# EAGLE schematic ServoCape_Rev2 (EAGLE 7.2.0)

## Sheet 1 of 4
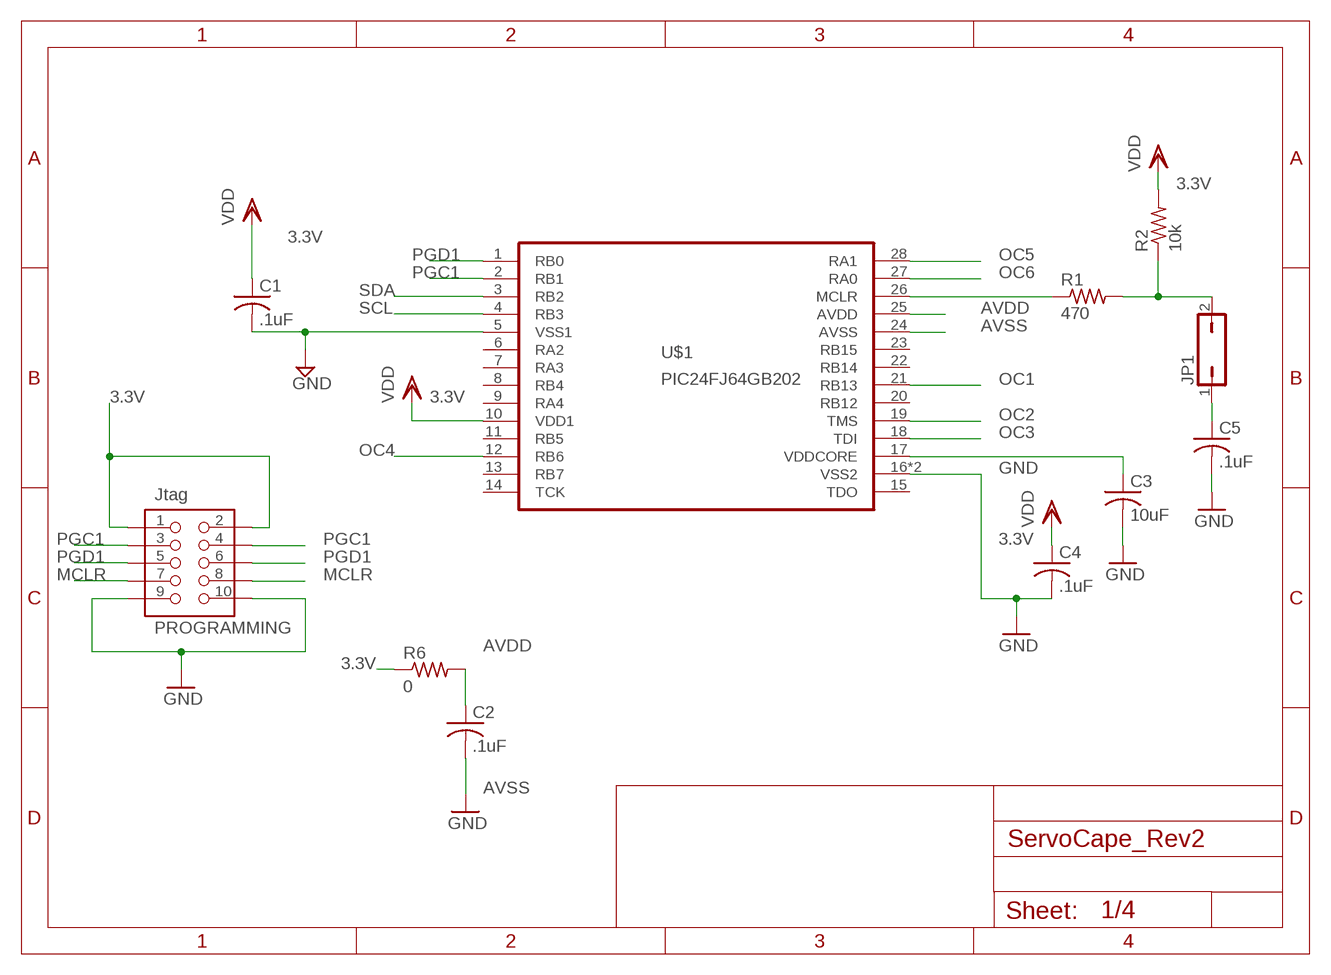
[diagram p0: schematic, sheet 1]

### Parts
C1  .1uF  C-USC0805K  [C0805K]
C2  .1uF  C-USC0805K  [C0805K]
C3  10uF  C-USC0805K  [C0805K]
C4  .1uF  C-USC0805K  [C0805K]
C5  .1uF  C-USC0805  [C0805]
JP1  JP1Q  [JP1]
PROGRAMMING  Jtag  MOTHER-BOARD-REV5_PIN-CONNECTOR74089  [MOTHER-BOARD-REV5_10-PIN-SMD]
R1  470  R-US_R0805  [R0805]
R2  10k  R-US_R0805  [R0805]
R6  0  R-US_R0402  [R0402]
U$1  PIC24FJ64GB202  [PIC24FJ64GB202]

### Nets
3.3V: C1.1 C4.1 PROGRAMMING.1 PROGRAMMING.2 R2.2 R6.1 U$1.10(VDD1) ; supply symbol labelled VDD ; also sheet 2
AVDD: C2.1 R6.2 U$1.25(AVDD)
AVSS: C2.2 U$1.24(AVSS) ; supply symbol labelled GND
GND: C1.2 C3.2 C4.2 C5.2 PROGRAMMING.9 PROGRAMMING.10 U$1.5(VSS1) U$1.16(VSS2) U$1.EXP(VSS2) ; also sheet 2,3,4
MCLR: PROGRAMMING.7 PROGRAMMING.8
N$1: JP1.2 R1.2 R2.1
N$2: R1.1 U$1.26(MCLR)
N$3: C3.1 U$1.17(VDDCORE)
N$4: C5.1 JP1.1
OC1: U$1.21(RB13) ; also sheet 4
OC2: U$1.19(TMS) ; also sheet 4
OC3: U$1.18(TDI) ; also sheet 4
OC4: U$1.12(RB6) ; also sheet 4
OC5: U$1.28(RA1) ; also sheet 4
OC6: U$1.27(RA0) ; also sheet 4
PGC1: PROGRAMMING.3 PROGRAMMING.4 U$1.2(RB1)
PGD1: PROGRAMMING.5 PROGRAMMING.6 U$1.1(RB0)
SCL: U$1.4(RB3) ; also sheet 3
SDA: U$1.3(RB2) ; also sheet 3
Unconnected: U$1.6(RA2) U$1.7(RA3) U$1.8(RB4) U$1.9(RA4) U$1.11(RB5) U$1.13(RB7) U$1.14(TCK) U$1.15(TDO) U$1.20(RB12) U$1.22(RB14) U$1.23(RB15)

## Sheet 2 of 4: Power System
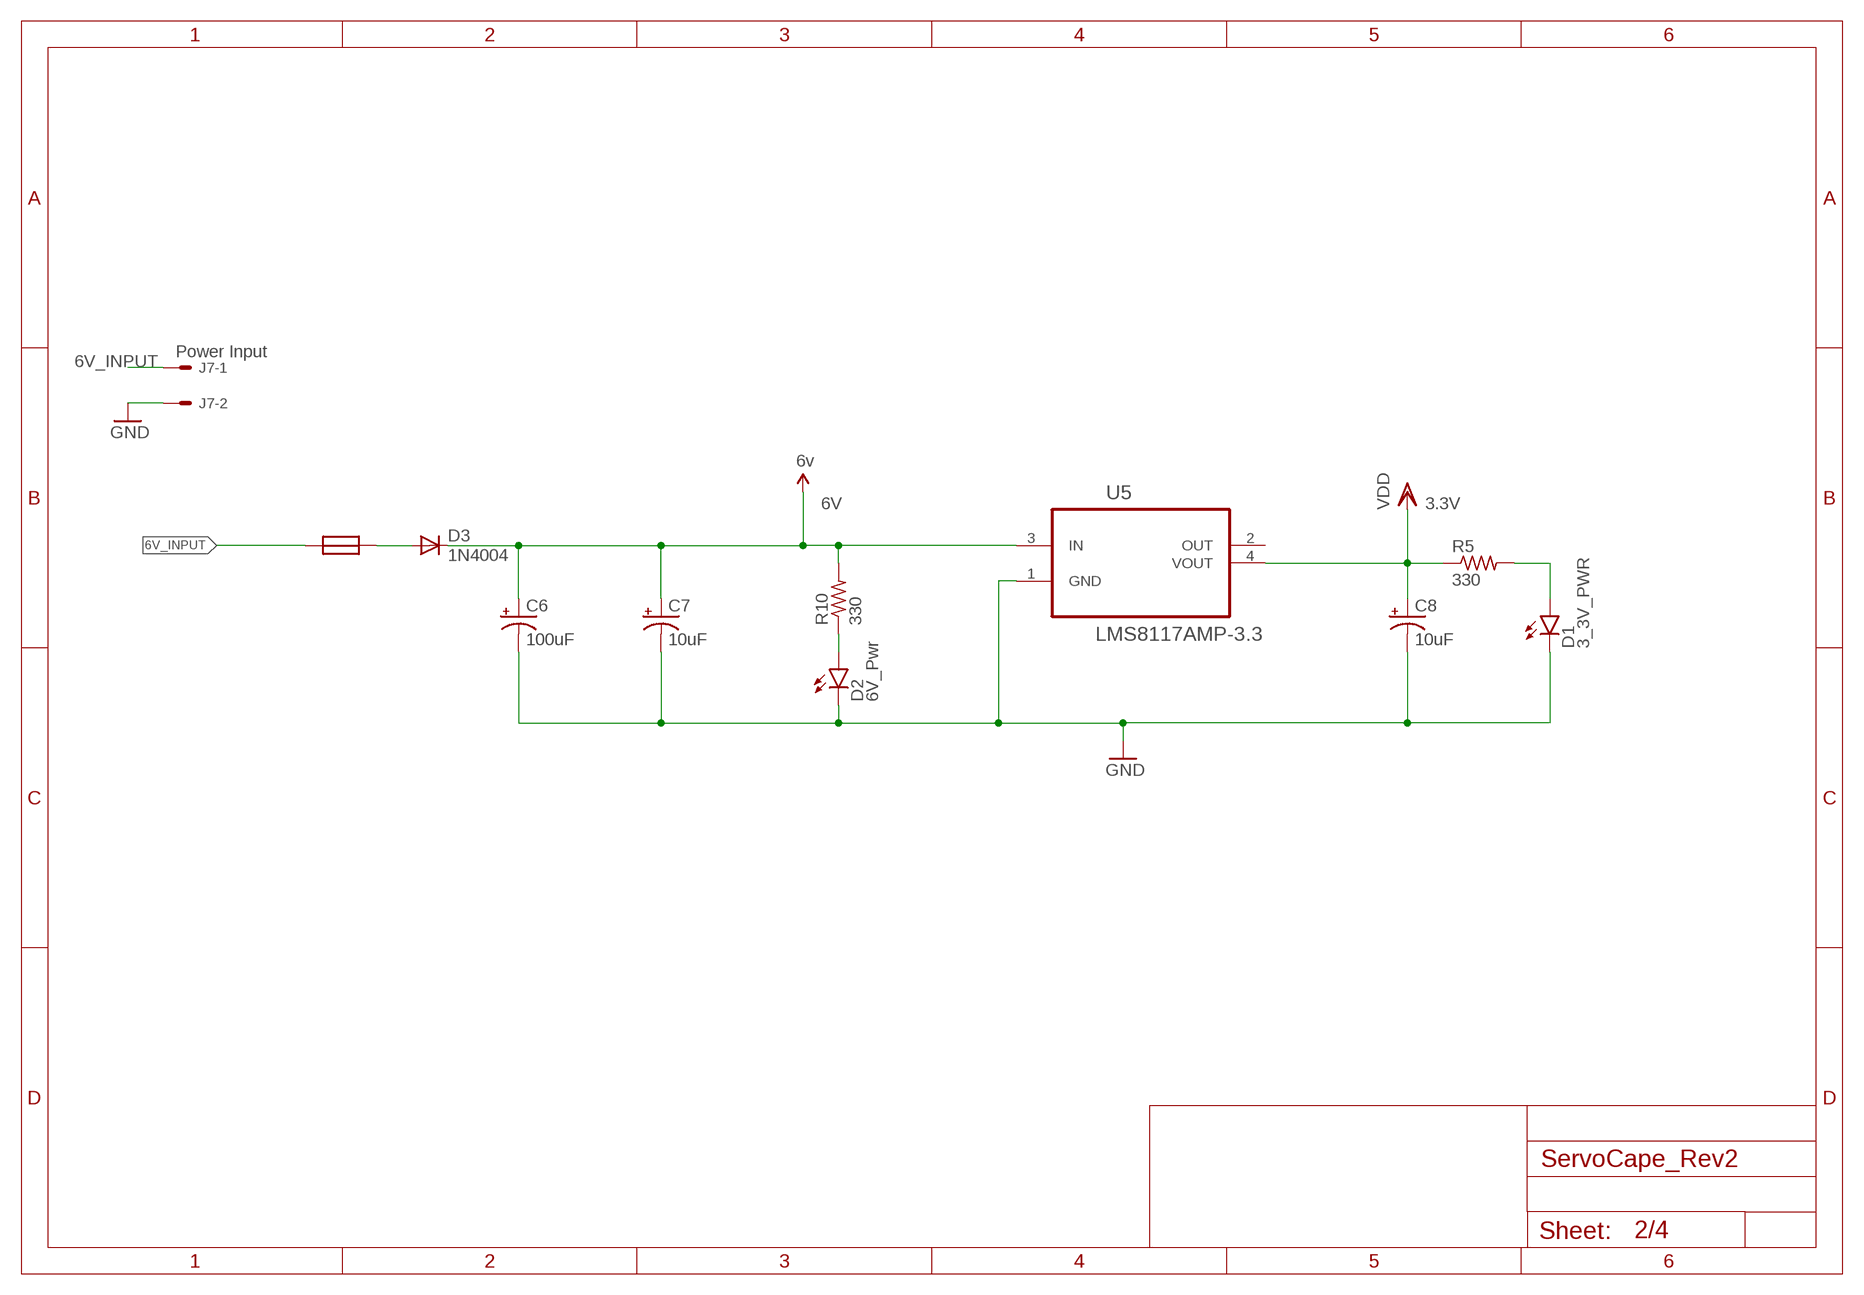
[diagram p1: schematic, sheet 2]

### Parts
C6  100uF  100UF-10V-10%(TANT)  [EIA7343]
C7  10uF  10UF-16V-10%(TANT)  [EIA3216]
C8  10uF  10UF-16V-10%(TANT)  [EIA3216]
D1  3_3V_PWR  LED-FKIT-1206  [FKIT-LED-1206]
D2  6V_Pwr  LED-FKIT-1206  [FKIT-LED-1206]
D3  1N4004  [DO41-10]
J7  Power Input  22-05-7028-02  [7395-02]
R5  330  R-US_R0805W  [R0805W]
R10  330  R-US_R0805W  [R0805W]
U5  LMS8117AMP-3.3  [SOT230P696X180-4N]
U$3  NANO_FUSE  [NANO_FUSE]

### Nets
3.3V: C8.A(+) R5.1 U5.4(VOUT) ; supply symbol labelled VDD ; also sheet 1
6V: C6.A(+) C7.A(+) D3.C R10.2 U5.3(IN) ; supply symbol labelled 6v ; also sheet 4
6V_INPUT: J7.1 U$3.1
GND: C6.C(-) C7.C(-) C8.C(-) D1.C D2.C J7.2 U5.1(GND) ; also sheet 1,3,4
N$6: D1.A R5.2
N$13: D2.A R10.1
N$14: D3.A U$3.2
Unconnected: U5.2(OUT)

## Sheet 3 of 4
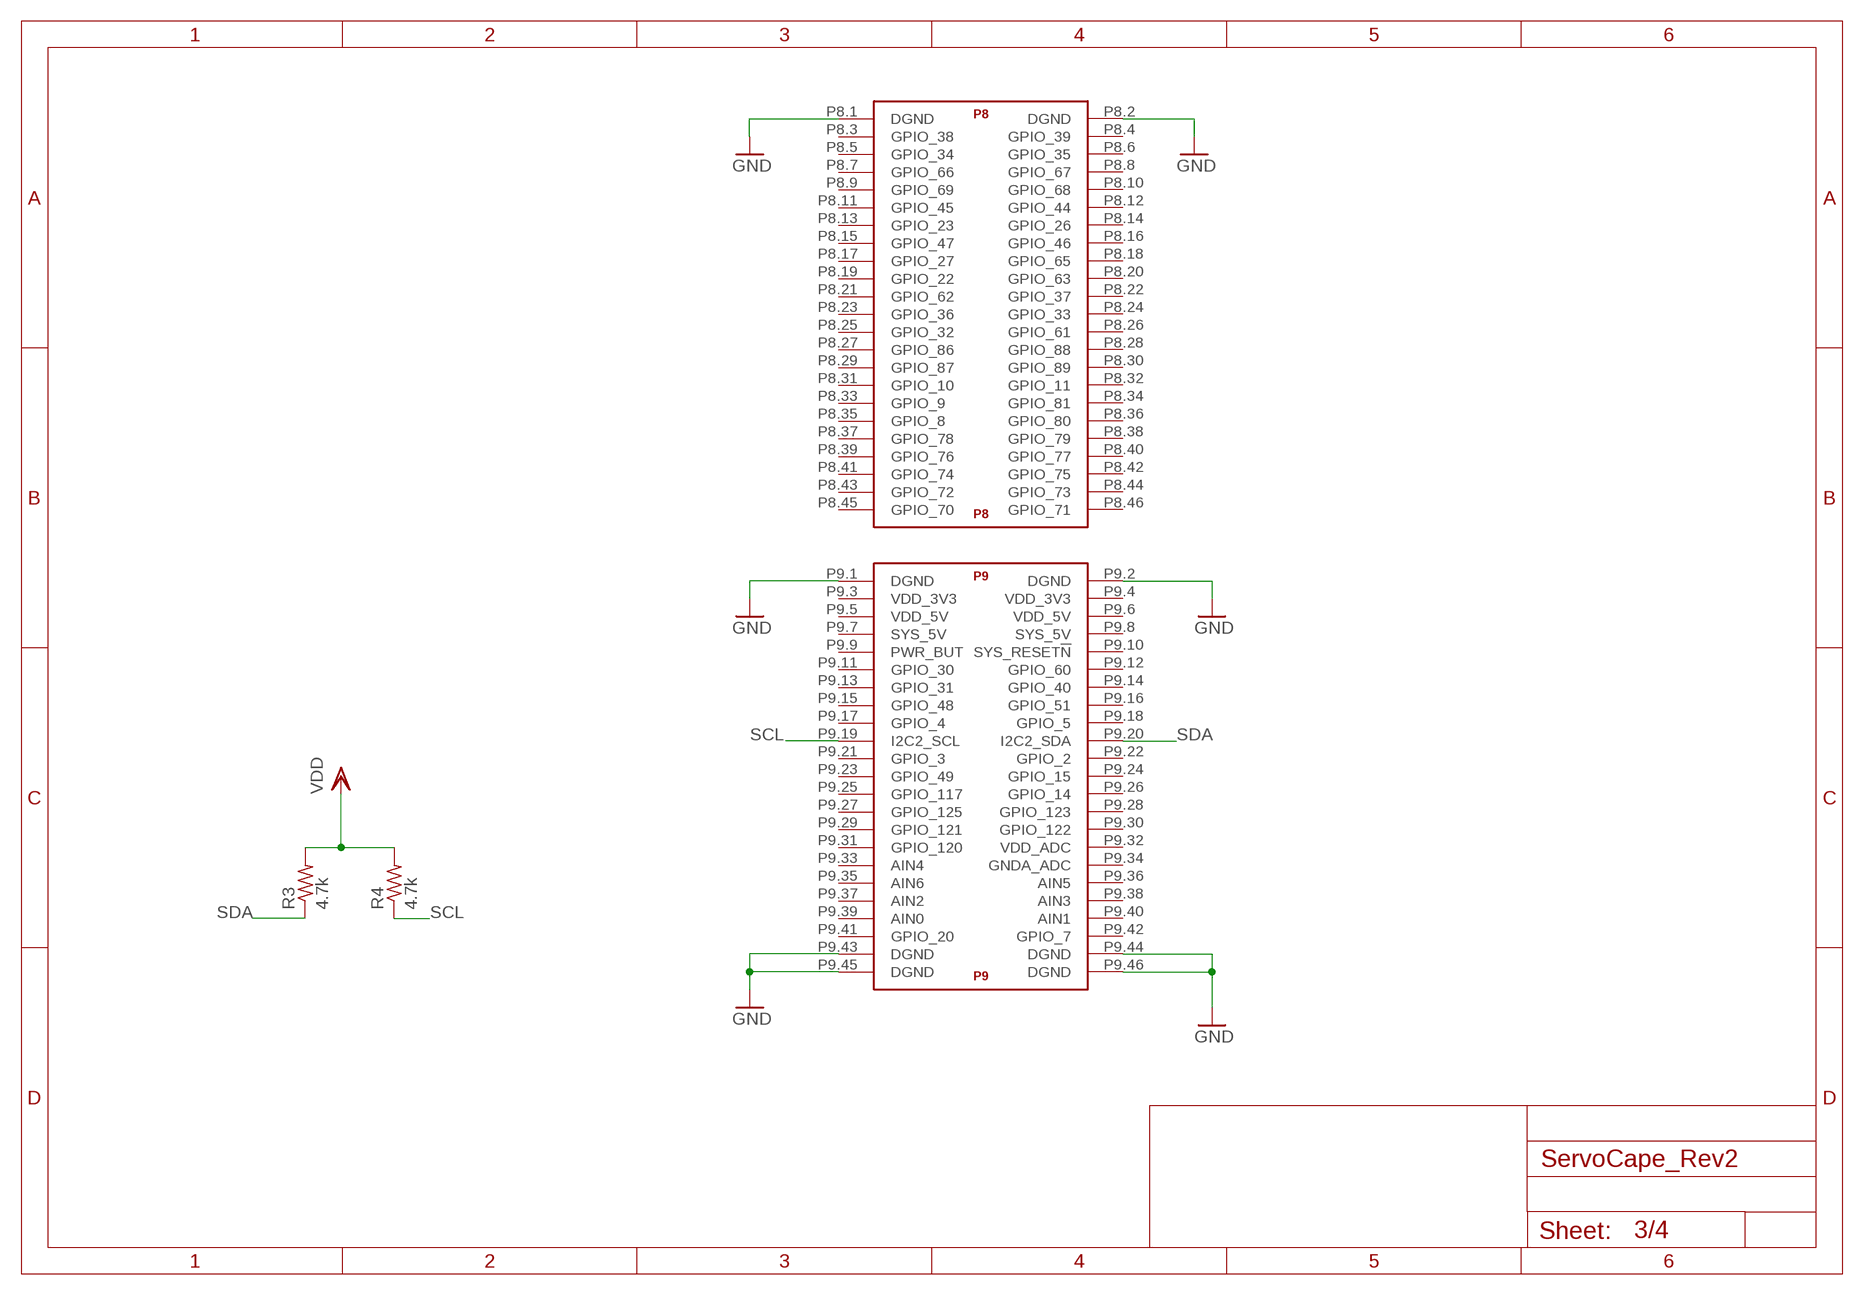
[diagram p2: schematic, sheet 3]

### Parts
R3  4.7k  R-US_R0805  [R0805]
R4  4.7k  R-US_R0805  [R0805]
U$2  BEAGLE_BONE_BLACK_CAPE  [BEAGLE_BONE_BLACK_CAPE]

### Nets
GND: U$2.P8.1(P8:DGND) U$2.P8.2(P8:DGND) U$2.P9.1(P9:DGND) U$2.P9.2(P9:DGND) U$2.P9.43(P9:DGND) U$2.P9.44(P9:DGND) U$2.P9.45(P9:DGND) U$2.P9.46(P9:DGND) ; also sheet 1,2,4
SCL: R4.1 U$2.P9.19(P9:I2C2_SCL) ; also sheet 1
SDA: R3.1 U$2.P9.20(P9:I2C2_SDA) ; also sheet 1
VDD: R3.2 R4.2
Unconnected: U$2.P8.3(P8:GPIO_38) U$2.P8.4(P8:GPIO_39) U$2.P8.5(P8:GPIO_34) U$2.P8.6(P8:GPIO_35) U$2.P8.7(P8:GPIO_66) U$2.P8.8(P8:GPIO_67) U$2.P8.9(P8:GPIO_69) U$2.P8.10(P8:GPIO_68) U$2.P8.11(P8:GPIO_45) U$2.P8.12(P8:GPIO_44) U$2.P8.13(P8:GPIO_23) U$2.P8.14(P8:GPIO_26) U$2.P8.15(P8:GPIO_47) U$2.P8.16(P8:GPIO_46) U$2.P8.17(P8:GPIO_27) U$2.P8.18(P8:GPIO_65) U$2.P8.19(P8:GPIO_22) U$2.P8.20(P8:GPIO_63) U$2.P8.21(P8:GPIO_62) U$2.P8.22(P8:GPIO_37) U$2.P8.23(P8:GPIO_36) U$2.P8.24(P8:GPIO_33) U$2.P8.25(P8:GPIO_32) U$2.P8.26(P8:GPIO_61) U$2.P8.27(P8:GPIO_86) U$2.P8.28(P8:GPIO_88) U$2.P8.29(P8:GPIO_87) U$2.P8.30(P8:GPIO_89) U$2.P8.31(P8:GPIO_10) U$2.P8.32(P8:GPIO_11) U$2.P8.33(P8:GPIO_9) U$2.P8.34(P8:GPIO_81) U$2.P8.35(P8:GPIO_8) U$2.P8.36(P8:GPIO_80) U$2.P8.37(P8:GPIO_78) U$2.P8.38(P8:GPIO_79) U$2.P8.39(P8:GPIO_76) U$2.P8.40(P8:GPIO_77) U$2.P8.41(P8:GPIO_74) U$2.P8.42(P8:GPIO_75) U$2.P8.43(P8:GPIO_72) U$2.P8.44(P8:GPIO_73) U$2.P8.45(P8:GPIO_70) U$2.P8.46(P8:GPIO_71) U$2.P9.3(P9:VDD_3V3) U$2.P9.4(P9:VDD_3V3) U$2.P9.5(P9:VDD_5V) U$2.P9.6(P9:VDD_5V) U$2.P9.7(P9:SYS_5V) U$2.P9.8(P9:SYS_5V) U$2.P9.9(P9:PWR_BUT) U$2.P9.10(P9:SYS_RESET!N) U$2.P9.11(P9:GPIO_30) U$2.P9.12(P9:GPIO_60) U$2.P9.13(P9:GPIO_31) U$2.P9.14(P9:GPIO_40) U$2.P9.15(P9:GPIO_48) U$2.P9.16(P9:GPIO_51) U$2.P9.17(P9:GPIO_4) U$2.P9.18(P9:GPIO_5) U$2.P9.21(P9:GPIO_3) U$2.P9.22(P9:GPIO_2) U$2.P9.23(P9:GPIO_49) U$2.P9.24(P9:GPIO_15) U$2.P9.25(P9:GPIO_117) U$2.P9.26(P9:GPIO_14) U$2.P9.27(P9:GPIO_125) U$2.P9.28(P9:GPIO_123) U$2.P9.29(P9:GPIO_121) U$2.P9.30(P9:GPIO_122) U$2.P9.31(P9:GPIO_120) U$2.P9.32(P9:VDD_ADC) U$2.P9.33(P9:AIN4) U$2.P9.34(P9:GNDA_ADC) U$2.P9.35(P9:AIN6) U$2.P9.36(P9:AIN5) U$2.P9.37(P9:AIN2) U$2.P9.38(P9:AIN3) U$2.P9.39(P9:AIN0) U$2.P9.40(P9:AIN1) U$2.P9.41(P9:GPIO_20) U$2.P9.42(P9:GPIO_7)

## Sheet 4 of 4
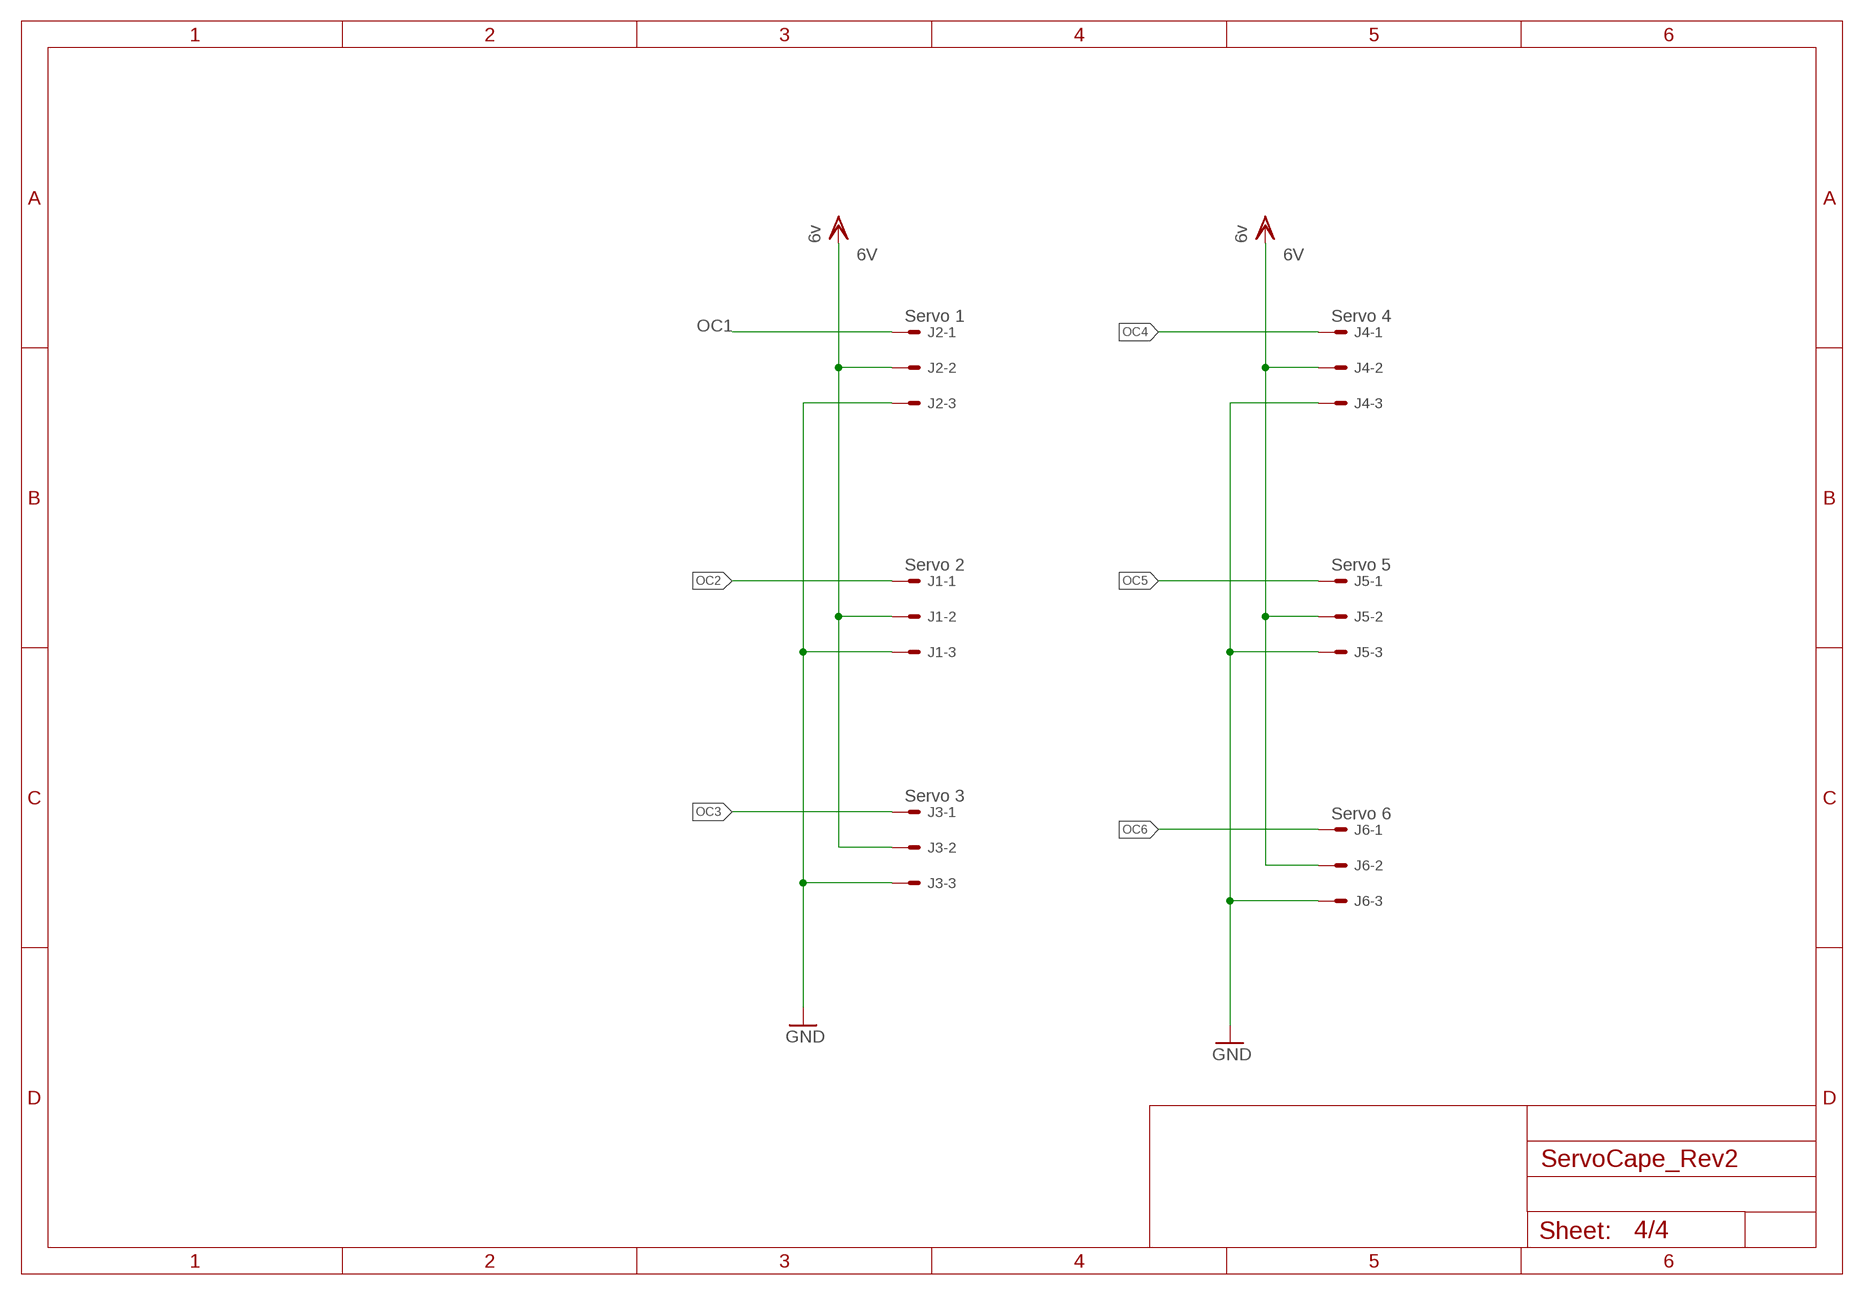
[diagram p3: schematic, sheet 4]

### Parts
J1  Servo 2  22-05-7038-03  [7395-03]
J2  Servo 1  22-05-7038-03  [7395-03]
J3  Servo 3  22-05-7038-03  [7395-03]
J4  Servo 4  22-05-7038-03  [7395-03]
J5  Servo 5  22-05-7038-03  [7395-03]
J6  Servo 6  22-05-7038-03  [7395-03]

### Nets
6V: J2.2 J4.2 ; supply symbol labelled 6v ; also sheet 2
+5V_SUPPLY2: J1.2
+5V_SUPPLY3: J3.2
+5V_SUPPLY5: J5.2
+5V_SUPPLY6: J6.2
GND: J3.3 J6.3 ; also sheet 1,2,3
GND_SUPPLY1: J2.3
GND_SUPPLY2: J1.3
GND_SUPPLY4: J4.3
GND_SUPPLY5: J5.3
OC1: J2.1 ; also sheet 1
OC2: J1.1 ; also sheet 1
OC3: J3.1 ; also sheet 1
OC4: J4.1 ; also sheet 1
OC5: J5.1 ; also sheet 1
OC6: J6.1 ; also sheet 1

## Library data of the parts
C1-C5 = rcl:C-US: CAPACITOR, American symbol
C6 = SparkFun-Capacitors:100UF-10V-10%(TANT): CAP-07890; PROD_ID: CAP-07890
C7 C8 = SparkFun-Capacitors:10UF-16V-10%(TANT): CAP-00811 1206/EIA-3216 Tantalum capacitor; PROD_ID: CAP-00811
D1 D2 = SparkFun-LED:LED: LEDs Standard schematic elements and footprints for 5mm, 3mm, 1206, and 0603 sized LEDs. 5mm - Spark Fun Electronics SKU : COM-00529 (and others)
D3 = diode:1N4004: DIODE general purpose rectifier, 1 A
J1-J6 = con-molex:22-?-03: CONNECTOR wire to board 2.54 mm (.1 inch) pitch header; OC_FARNELL: unknown; OC_NEWARK: unknown
J7 = con-molex:22-?-02: CONNECTOR wire to board 2.54 mm (.1 inch) pitch header; OC_FARNELL: 9731601; OC_NEWARK: unknown
JP1 = jumper:JP1Q: JUMPER
PROGRAMMING = Mother-Board-rev5:MOTHER-BOARD-REV5_PIN-CONNECTOR
R1-R6 R10 = rcl:R-US_: RESISTOR, American symbol
U5 = NSC-LMS8117AMP:LMS8117AMP-3.3: Low-Dropout Linear Regulator; MPN: LMS8117AMP-3.3; OC_FARNELL: 1469032; OC_NEWARK: 41K3020; PACKAGE: SOT-223-3; SUPPLIER: National Semiconductor
U$1 = ServoCape:PIC24FJ64GB202
U$2 = SparkFun-Boards:BEAGLE_BONE_BLACK_CAPE
U$3 = custom_fuses:NANO_FUSE

## Net classes
0 default: width 0.203 mm, drill 0.508 mm, clearance 0.254 mm